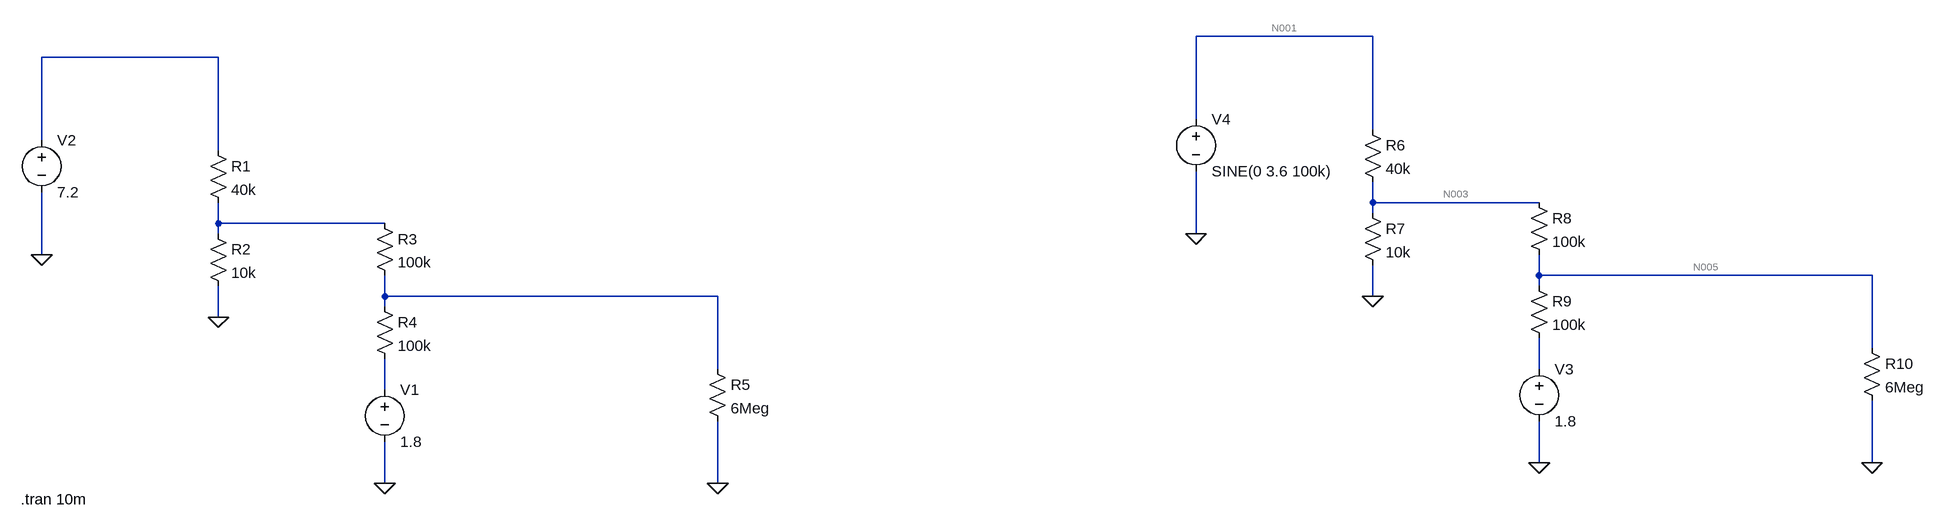
[diagram p0: schematic divider_network_vmon.asc]
divider_network_vmon.asc, the LTspice schematic file:
Version 4.1
SHEET 1 2664 680
WIRE 1808 -96 1536 -96
WIRE 32 -64 -240 -64
WIRE 1536 32 1536 -96
WIRE 1808 48 1808 -96
WIRE -240 64 -240 -64
WIRE 32 80 32 -64
WIRE 1808 160 1808 128
WIRE 2064 160 1808 160
WIRE 1808 176 1808 160
WIRE 32 192 32 160
WIRE 288 192 32 192
WIRE 32 208 32 192
WIRE 1536 208 1536 112
WIRE -240 240 -240 144
WIRE 2064 272 2064 240
WIRE 2576 272 2064 272
WIRE 2064 288 2064 272
WIRE 288 304 288 272
WIRE 800 304 288 304
WIRE 1808 304 1808 256
WIRE 288 320 288 304
WIRE 32 336 32 288
WIRE 2576 384 2576 272
WIRE 800 416 800 304
WIRE 2064 416 2064 368
WIRE 288 448 288 400
WIRE 2064 560 2064 496
WIRE 2576 560 2576 464
WIRE 288 592 288 528
WIRE 800 592 800 496
FLAG 32 336 0
FLAG -240 240 0
FLAG 288 592 0
FLAG 800 592 0
FLAG 1808 304 0
FLAG 1536 208 0
FLAG 2064 560 0
FLAG 2576 560 0
SYMBOL res 16 64 R0
SYMATTR InstName R1
SYMATTR Value 40k
SYMBOL res 16 192 R0
SYMATTR InstName R2
SYMATTR Value 10k
SYMBOL res 272 176 R0
SYMATTR InstName R3
SYMATTR Value 100k
SYMBOL res 272 304 R0
SYMATTR InstName R4
SYMATTR Value 100k
SYMBOL voltage 288 432 R0
WINDOW 123 0 0 Left 0
WINDOW 39 0 0 Left 0
SYMATTR InstName V1
SYMATTR Value 1.8
SYMBOL voltage -240 48 R0
WINDOW 123 0 0 Left 0
WINDOW 39 0 0 Left 0
SYMATTR InstName V2
SYMATTR Value 7.2
SYMBOL res 784 400 R0
SYMATTR InstName R5
SYMATTR Value 6Meg
SYMBOL res 1792 32 R0
SYMATTR InstName R6
SYMATTR Value 40k
SYMBOL res 1792 160 R0
SYMATTR InstName R7
SYMATTR Value 10k
SYMBOL res 2048 144 R0
SYMATTR InstName R8
SYMATTR Value 100k
SYMBOL res 2048 272 R0
SYMATTR InstName R9
SYMATTR Value 100k
SYMBOL voltage 2064 400 R0
WINDOW 123 0 0 Left 0
WINDOW 39 0 0 Left 0
SYMATTR InstName V3
SYMATTR Value 1.8
SYMBOL voltage 1536 16 R0
WINDOW 123 0 0 Left 0
WINDOW 39 0 0 Left 0
SYMATTR InstName V4
SYMATTR Value SINE(0 3.6 100k)
SYMBOL res 2560 368 R0
SYMATTR InstName R10
SYMATTR Value 6Meg
TEXT -272 616 Left 2 !.tran 10m

The netlist it stands for:
* divider_network_vmon.asc
R1 N002 N004 40k
R2 N004 0 10k
R3 N004 N006 100k
R4 N006 N008 100k
V1 N008 0 1.8
V2 N002 0 7.2
R5 N006 0 6Meg
R6 N001 N003 40k
R7 N003 0 10k
R8 N003 N005 100k
R9 N005 N007 100k
V3 N007 0 1.8
V4 N001 0 SINE(0 3.6 100k)
R10 N005 0 6Meg
.tran 10m
.backanno
.end

* Results of the author's LTspice run, read from the files saved beside the schematic
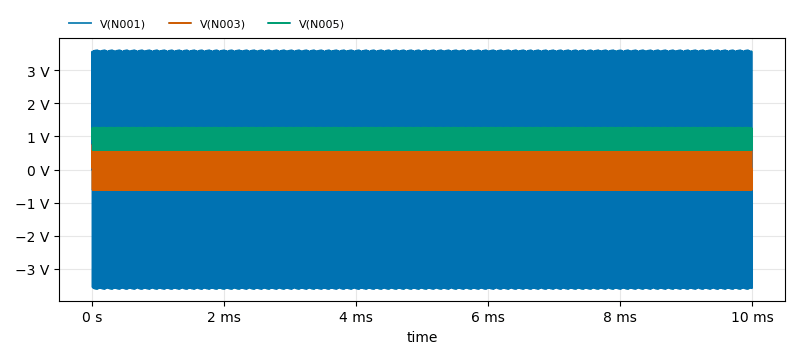
[diagram p1: Transient Analysis of divider_network_vmon.asc, plotted from the saved traces]
* Transient Analysis, 1 run:
*   V(N001): min -3.6 V, max 3.6 V, average 6.011 µV, rms 2.59 V, last 0 V
*   V(N003): min -619.4 mV, max 756.7 mV, average 68.64 mV, rms 484.5 mV, last 68.64 mV
*   V(N005): min 585.4 mV, max 1.268 V, average 926.6 mV, rms 956.6 mV, last 926.6 mV